# EAGLE schematic stm32-40 (EAGLE 6.5.0)
40 pin mesonine module. 2 inch beetween pinheads.

## Sheet 1 of 2
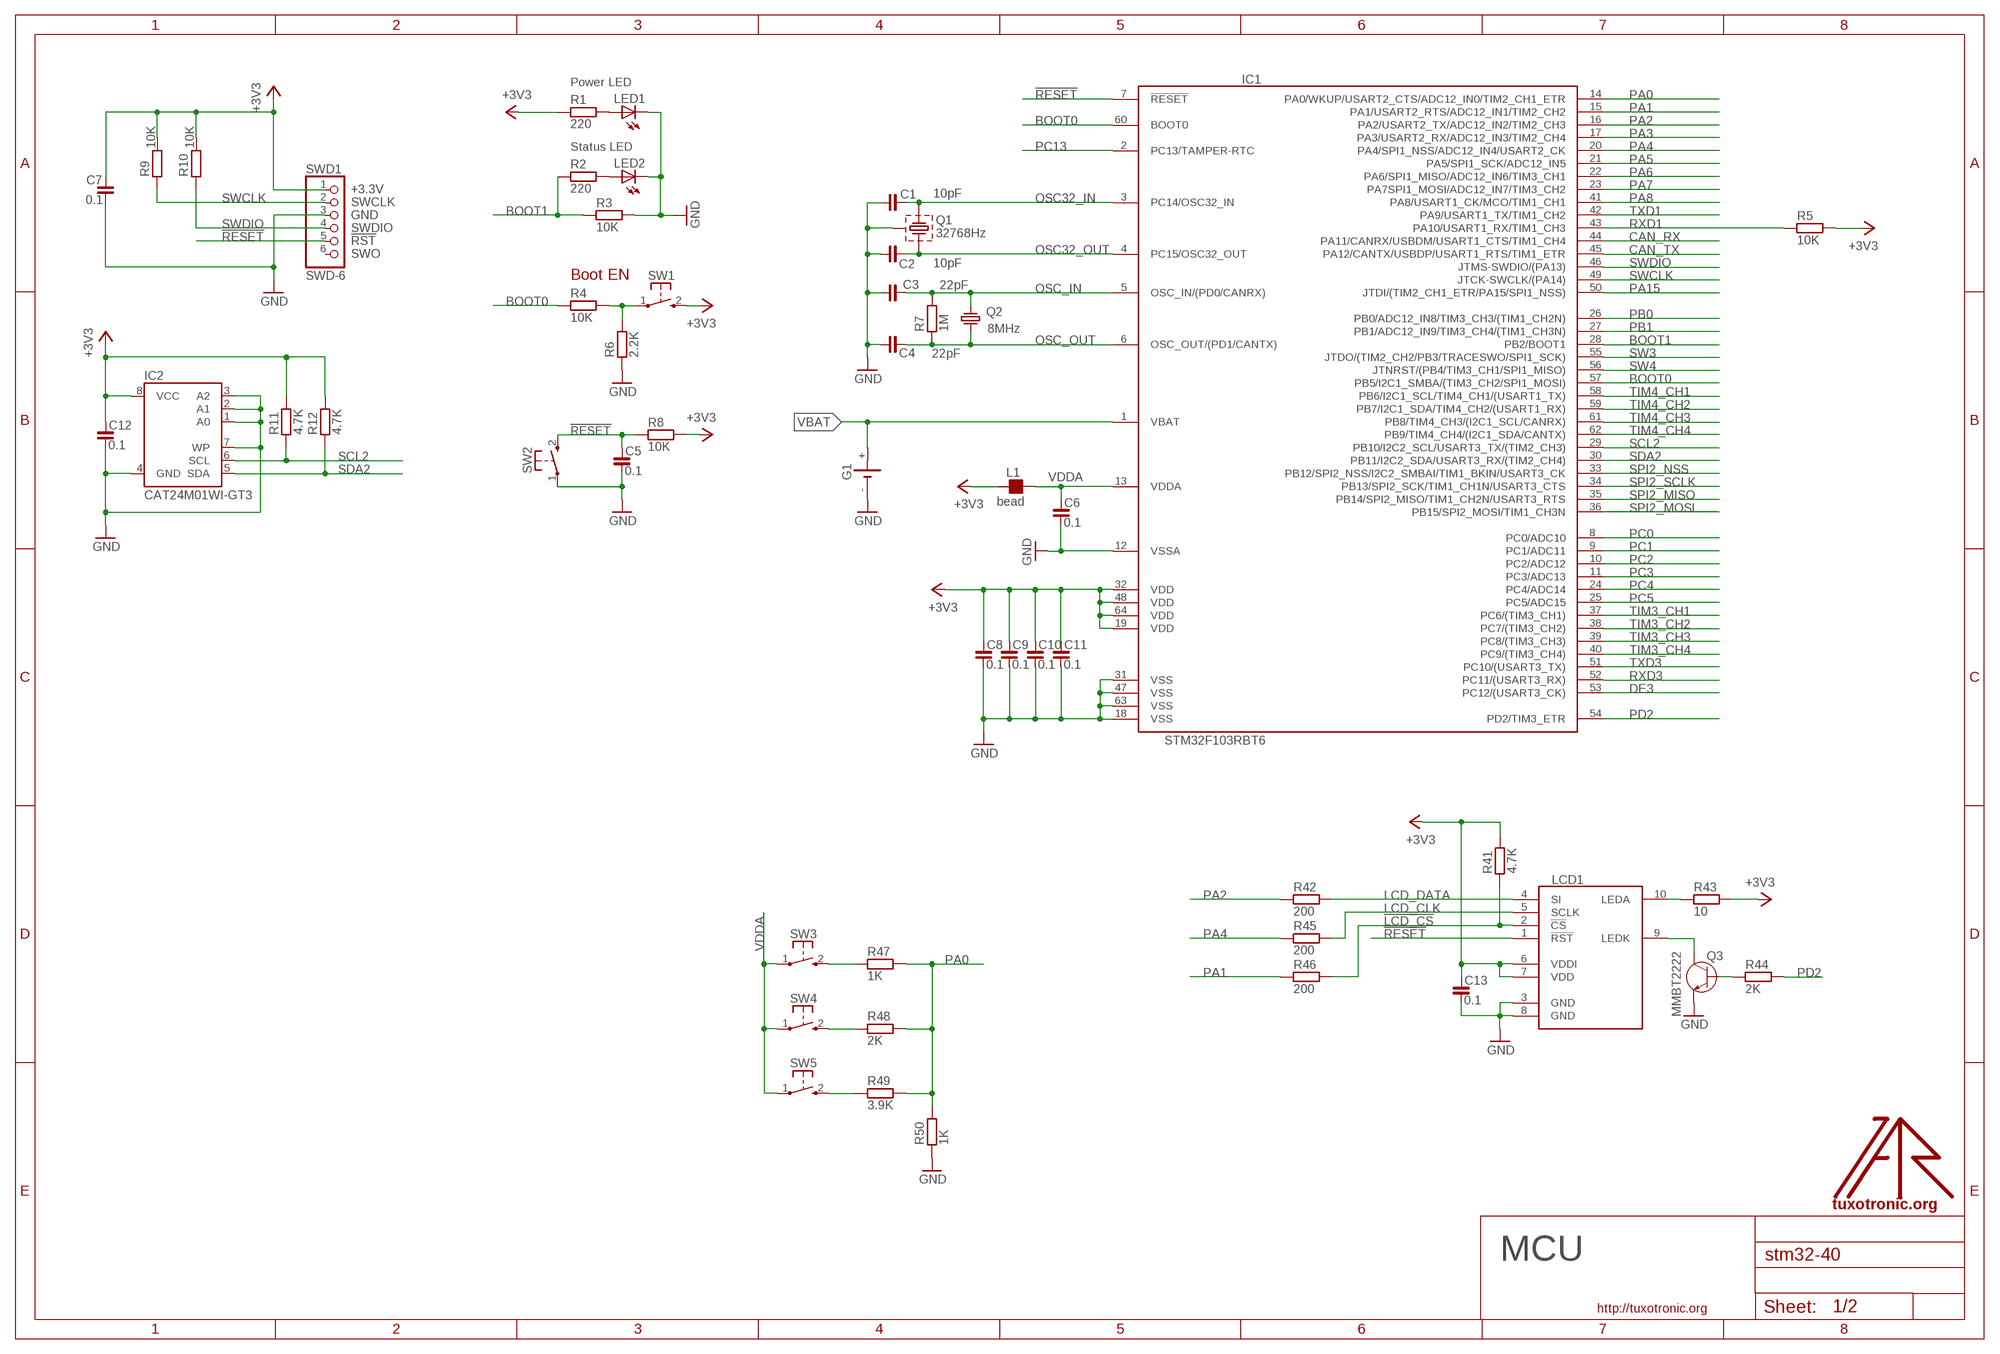
[diagram p0: schematic, sheet 1]

### Parts
C1  10pF  C_0603  [C0603]
C2  10pF  C_0603  [C0603]
C3  22pF  C_0603  [C0603]
C4  22pF  C_0603  [C0603]
C5  0.1  C_0603  [C0603]
C6  0.1  C_0603  [C0603]
C7  0.1  C_0603  [C0603]
C8  0.1  C_0603  [C0603]
C9  0.1  C_0603  [C0603]
C10  0.1  C_0603  [C0603]
C11  0.1  C_0603  [C0603]
C12  0.1  C_0603  [C0603]
C13  0.1  C_0603  [C0603]
G1  1220SMT  [SMT1220]
IC1  STM32F103RBT6  STM32F103R  [TQFP64]
IC2  CAT24M01WI-GT3  AT24C256S  [SO08]
L1  bead  FB_0603  [L0603]
LCD1  LCD1202-EXT  [NOKIA1202LCD-EXT]
LED1  LEDCHIP-LED0805  [CHIP-LED0805]
LED2  LEDCHIP-LED0805  [CHIP-LED0805]
Q1  32768Hz  CRSTL3-  [TC38H-G]
Q2  8MHz  CRYSTAL-HC49S  [HC49/S]
Q3  MMBT2222  [SOT23]
R1  220  R_0603  [R0603]
R2  220  R_0603  [R0603]
R3  10K  R_0603  [R0603]
R4  10K  R_0603  [R0603]
R5  10K  R_0603  [R0603]
R6  2.2K  R_0603  [R0603]
R7  1M  R_0603  [R0603]
R8  10K  R_0603  [R0603]
R9  10K  R_0603  [R0603]
R10  10K  R_0603  [R0603]
R11  4.7K  R_0603  [R0603]
R12  4.7K  R_0603  [R0603]
R41  4.7K  R_0603  [R0603]
R42  200  R_0603  [R0603]
R43  10  R_0603  [R0603]
R44  2K  R_0603  [R0603]
R45  200  R_0603  [R0603]
R46  200  R_0603  [R0603]
R47  1K  R_0603  [R0603]
R48  2K  R_0603  [R0603]
R49  3.9K  R_0603  [R0603]
R50  1K  R_0603  [R0603]
SW1  KSS-2EG4430  [KSS-2EG4430]
SW2  KSS-2EG4430  [KSS-2EG4430]
SW3  KSS-2EG4430  [KSS-2EG4430]
SW4  KSS-2EG4430  [KSS-2EG4430]
SW5  KSS-2EG4430  [KSS-2EG4430]
SWD1  SWD-6  [JTAG6PIN]
U$1  LOGO  [TT_LOGO]

### Nets
!LCD_CS: LCD1.2(!CS) R41.1 R46.2
!RESET: C5.1 IC1.7(!RESET) LCD1.1(!RST) R8.1 SW2.2(S) SWD1.5
+3V3: C7.1 C8.1 C9.1 C10.1 C11.1 C12.1 C13.1 IC1.19(VDD) IC1.32(VDD) IC1.48(VDD) IC1.64(VDD) IC2.8(VCC) L1.1 LCD1.6(VDDI) LCD1.7(VDD) R1.1 R5.2 R8.2 R9.2 R10.2 R11.2 R12.2 R41.2 R43.2 SW1.2(S) SWD1.1 ; also sheet 2
BOOT0: IC1.57(PB5/I2C1_SMBA/(TIM3_CH2/SPI1_MOSI)) IC1.60(BOOT0) R4.1
BOOT1: IC1.28(PB2/BOOT1) R2.1 R3.1
CAN_RX: IC1.44(PA11/CANRX/USBDM/USART1_CTS/TIM1_CH4) ; also sheet 2
CAN_TX: IC1.45(PA12/CANTX/USBDP/USART1_RTS/TIM1_ETR) ; also sheet 2
DE3: IC1.53(PC12/(USART3_CK)) ; also sheet 2
GND: C1.2 C2.2 C3.2 C4.2 C5.2 C6.2 C7.2 C8.2 C9.2 C10.2 C11.2 C12.2 C13.2 G1.- IC1.12(VSSA) IC1.18(VSS) IC1.31(VSS) IC1.47(VSS) IC1.63(VSS) IC2.1(A0) IC2.2(A1) IC2.3(A2) IC2.4(GND) IC2.7(WP) LCD1.3(GND) LCD1.8(GND) LED1.C LED2.C Q1.GND Q3.2(E) R3.2 R6.1 R50.1 SW2.1(P) SWD1.3 ; also sheet 2
LCD_CLK: LCD1.5(SCLK) R45.2
LCD_DATA: LCD1.4(SI) R42.2
N$3: R4.2 R6.2 SW1.1(P)
N$13: LED1.A R1.2
N$29: LCD1.9(LEDK) Q3.3(C)
N$30: LED2.A R2.2
N$31: LCD1.10(LEDA) R43.1
N$32: Q3.1(B) R44.1
N$33: R47.1 SW3.2(S)
N$34: R48.1 SW4.2(S)
N$35: R49.1 SW5.2(S)
OSC32_IN: C1.1 IC1.3(PC14/OSC32_IN) Q1.2
OSC32_OUT: C2.1 IC1.4(PC15/OSC32_OUT) Q1.1
OSC_IN: C3.1 IC1.5(OSC_IN/(PD0/CANRX)) Q2.1 R7.2
OSC_OUT: C4.1 IC1.6(OSC_OUT/(PD1/CANTX)) Q2.2 R7.1
PA0: IC1.14(PA0/WKUP/USART2_CTS/ADC12_IN0/TIM2_CH1_ETR) R47.2 R48.2 R49.2 R50.2 ; also sheet 2
PA1: IC1.15(PA1/USART2_RTS/ADC12_IN1/TIM2_CH2) R46.1 ; also sheet 2
PA2: IC1.16(PA2/USART2_TX/ADC12_IN2/TIM2_CH3) R42.1 ; also sheet 2
PA3: IC1.17(PA3/USART2_RX/ADC12_IN3/TIM2_CH4) ; also sheet 2
PA4: IC1.20(PA4/SPI1_NSS/ADC12_IN4/USART2_CK) R45.1 ; also sheet 2
PA5: IC1.21(PA5/SPI1_SCK/ADC12_IN5) ; also sheet 2
PA6: IC1.22(PA6/SPI1_MISO/ADC12_IN6/TIM3_CH1) ; also sheet 2
PA7: IC1.23(PA7SPI1_MOSI/ADC12_IN7/TIM3_CH2) ; also sheet 2
PA8: IC1.41(PA8/USART1_CK/MCO/TIM1_CH1) ; also sheet 2
PA15: IC1.50(JTDI/(TIM2_CH1_ETR/PA15/SPI1_NSS)) ; also sheet 2
PB0: IC1.26(PB0/ADC12_IN8/TIM3_CH3/(TIM1_CH2N)) ; also sheet 2
PB1: IC1.27(PB1/ADC12_IN9/TIM3_CH4/(TIM1_CH3N)) ; also sheet 2
PC0: IC1.8(PC0/ADC10) ; also sheet 2
PC1: IC1.9(PC1/ADC11) ; also sheet 2
PC2: IC1.10(PC2/ADC12) ; also sheet 2
PC3: IC1.11(PC3/ADC13) ; also sheet 2
PC4: IC1.24(PC4/ADC14) ; also sheet 2
PC5: IC1.25(PC5/ADC15) ; also sheet 2
PC13: IC1.2(PC13/TAMPER-RTC) ; also sheet 2
PD2: IC1.54(PD2/TIM3_ETR) R44.2 ; also sheet 2
RXD1: IC1.43(PA10/USART1_RX/TIM1_CH3) R5.1 ; also sheet 2
RXD3: IC1.52(PC11/(USART3_RX)) ; also sheet 2
SCL2: IC1.29(PB10/I2C2_SCL/USART3_TX/(TIM2_CH3)) IC2.6(SCL) R11.1 ; also sheet 2
SDA2: IC1.30(PB11/I2C2_SDA/USART3_RX/(TIM2_CH4)) IC2.5(SDA) R12.1 ; also sheet 2
SPI2_MISO: IC1.35(PB14/SPI2_MISO/TIM1_CH2N/USART3_RTS) ; also sheet 2
SPI2_MOSI: IC1.36(PB15/SPI2_MOSI/TIM1_CH3N) ; also sheet 2
SPI2_NSS: IC1.33(PB12/SPI2_NSS/I2C2_SMBAI/TIM1_BKIN/USART3_CK) ; also sheet 2
SPI2_SCLK: IC1.34(PB13/SPI2_SCK/TIM1_CH1N/USART3_CTS) ; also sheet 2
SW3: IC1.55(JTDO/(TIM2_CH2/PB3/TRACESWO/SPI1_SCK)) ; also sheet 2
SW4: IC1.56(JTNRST/(PB4/TIM3_CH1/SPI1_MISO)) ; also sheet 2
SWCLK: IC1.49(JTCK-SWCLK/(PA14)) R9.1 SWD1.2
SWDIO: IC1.46(JTMS-SWDIO/(PA13)) R10.1 SWD1.4
TIM3_CH1: IC1.37(PC6/(TIM3_CH1)) ; also sheet 2
TIM3_CH2: IC1.38(PC7/(TIM3_CH2)) ; also sheet 2
TIM3_CH3: IC1.39(PC8/(TIM3_CH3)) ; also sheet 2
TIM3_CH4: IC1.40(PC9/(TIM3_CH4)) ; also sheet 2
TIM4_CH1: IC1.58(PB6/I2C1_SCL/TIM4_CH1/(USART1_TX)) ; also sheet 2
TIM4_CH2: IC1.59(PB7/I2C1_SDA/TIM4_CH2/(USART1_RX)) ; also sheet 2
TIM4_CH3: IC1.61(PB8/TIM4_CH3/(I2C1_SCL/CANRX)) ; also sheet 2
TIM4_CH4: IC1.62(PB9/TIM4_CH4/(I2C1_SDA/CANTX)) ; also sheet 2
TXD1: IC1.42(PA9/USART1_TX/TIM1_CH2) ; also sheet 2
TXD3: IC1.51(PC10/(USART3_TX)) ; also sheet 2
VBAT: G1.+ IC1.1(VBAT)
VDDA: C6.1 IC1.13(VDDA) L1.2 SW3.1(P) SW4.1(P) SW5.1(P)
Unconnected: SWD1.6

### Notes on the sheet
- Power LED
- Status LED
- Boot EN
- MCU

## Sheet 2 of 2
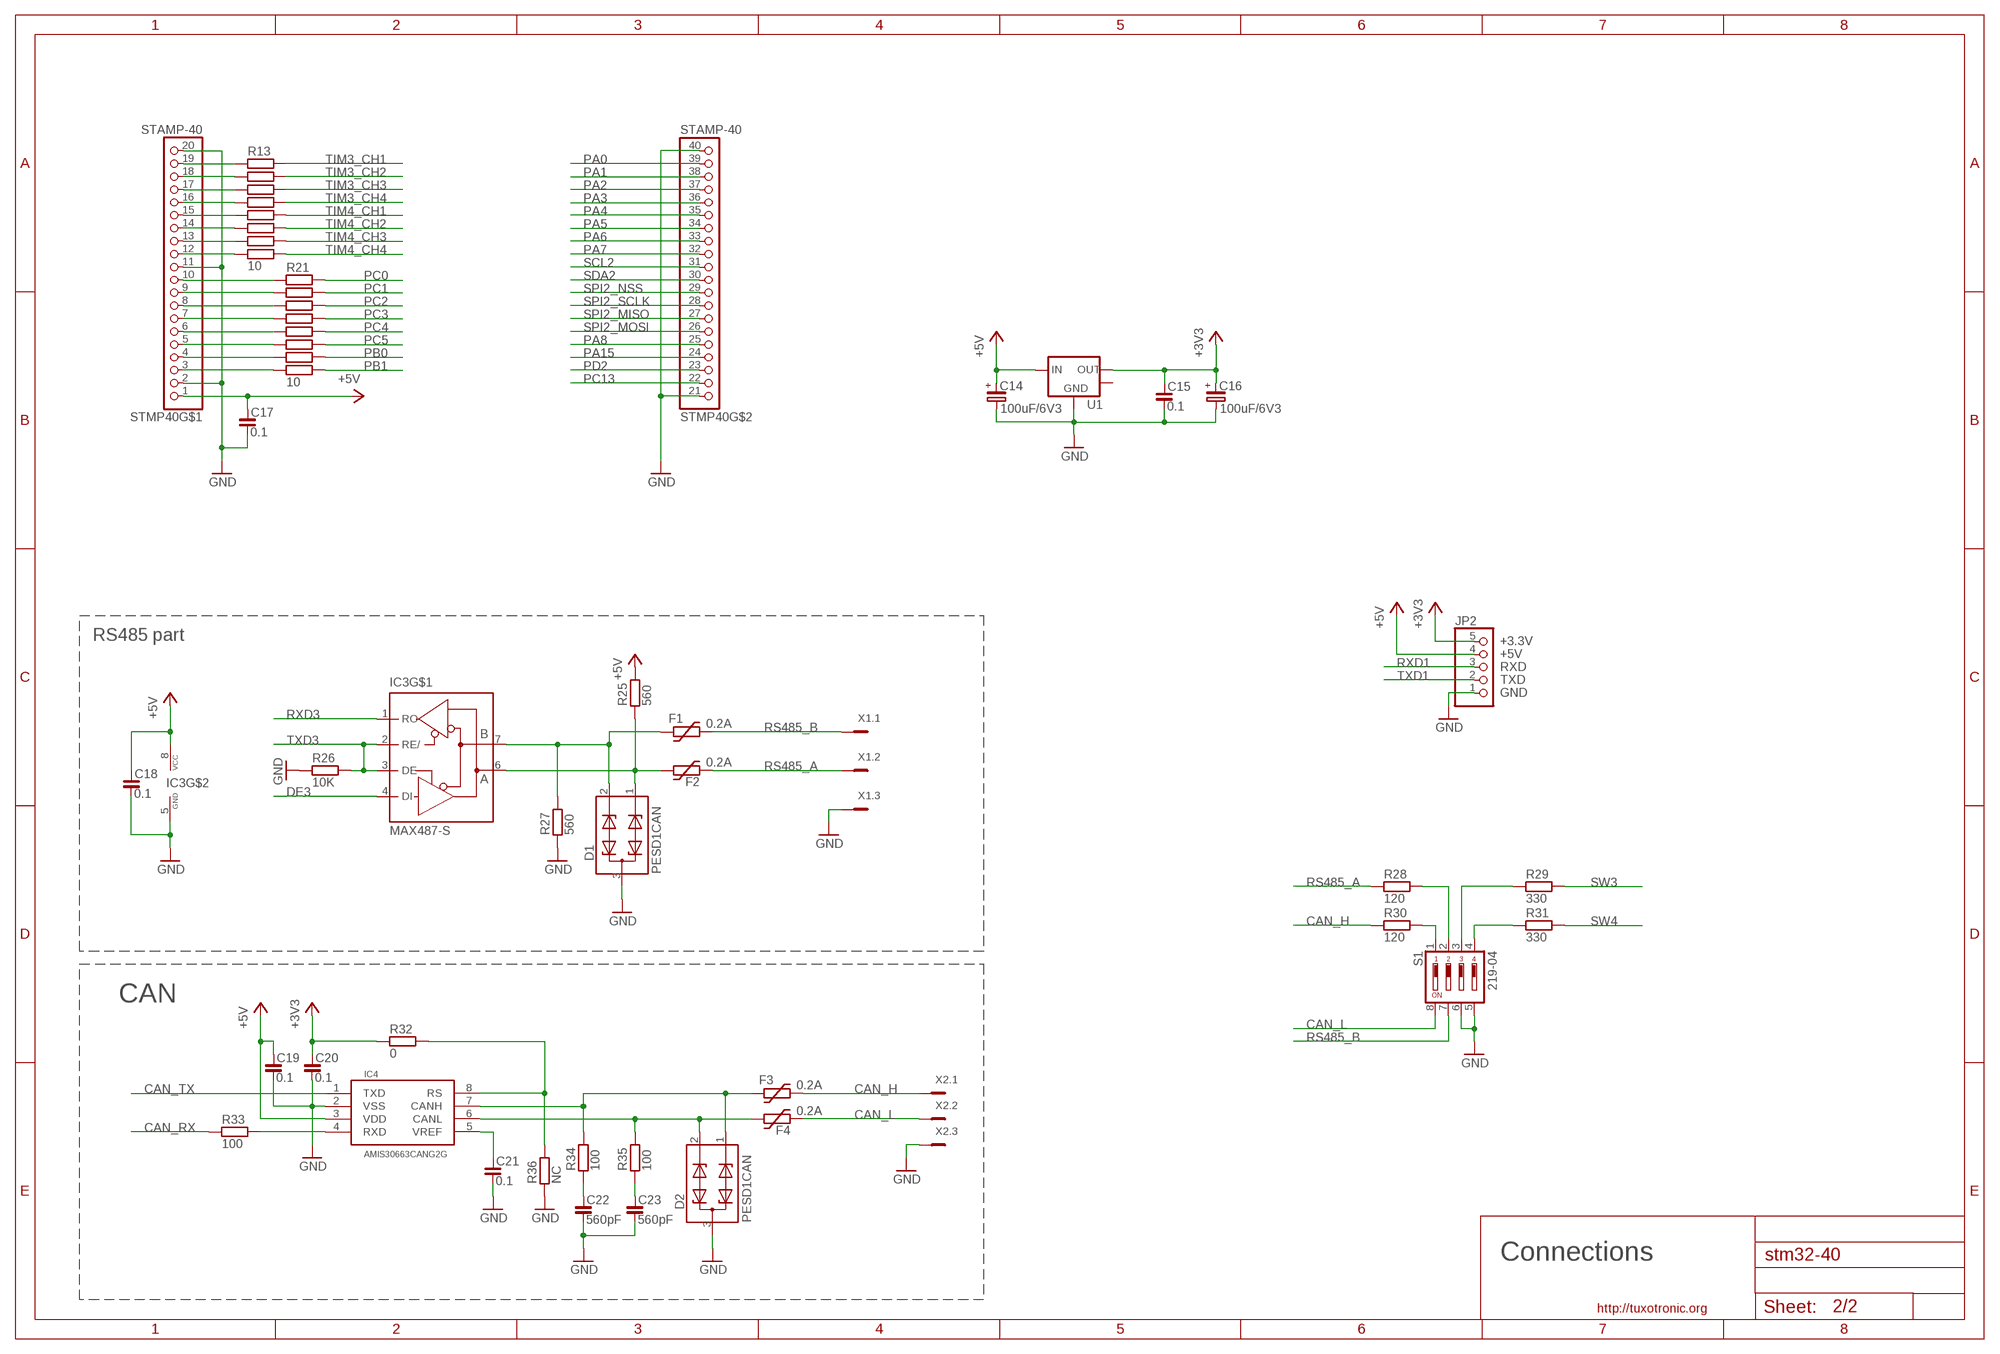
[diagram p1: schematic, sheet 2]

### Parts
C14  100uF/6V3  CP_SMCD  [SMC_D]
C15  0.1  C_0805  [C0805]
C16  100uF/6V3  CP_SMCD  [SMC_D]
C17  0.1  C_0805  [C0805]
C18  0.1  C_0603  [C0603]
C19  0.1  C_0603  [C0603]
C20  0.1  C_0603  [C0603]
C21  0.1  C_0603  [C0603]
C22  560pF  C_0603  [C0603]
C23  560pF  C_0603  [C0603]
D1  PESD1CAN  [SOT23]
D2  PESD1CAN  [SOT23]
F1  0.2A  1206L  [1206L]
F2  0.2A  1206L  [1206L]
F3  0.2A  1206L  [1206L]
F4  0.2A  1206L  [1206L]
IC3  MAX487-S  [SO08]
IC4  AMIS30663CANG2G  SN65HVD230  [SO08]
JP2  UART-5_2.54  [UART_1X05]
R13  10  R_0603  [R0603]
R14  10  R_0603  [R0603]
R15  10  R_0603  [R0603]
R16  10  R_0603  [R0603]
R17  10  R_0603  [R0603]
R18  10  R_0603  [R0603]
R19  10  R_0603  [R0603]
R20  10  R_0603  [R0603]
R21  10  R_0603  [R0603]
R22  10  R_0603  [R0603]
R23  10  R_0603  [R0603]
R24  10  R_0603  [R0603]
R25  560  R_0603  [R0603]
R26  10K  R_0603  [R0603]
R27  560  R_0603  [R0603]
R28  120  R_0805  [R0805]
R29  330  R_0603  [R0603]
R30  120  R_0805  [R0805]
R31  330  R_0603  [R0603]
R32  0  R_0603  [R0603]
R33  100  R_0603  [R0603]
R34  100  R_0603  [R0603]
R35  100  R_0603  [R0603]
R36  NC  R_0603  [R0603]
R37  10  R_0603  [R0603]
R38  10  R_0603  [R0603]
R39  10  R_0603  [R0603]
R40  10  R_0603  [R0603]
S1  219-04  [CTS-219-04]
STMP40  STAMP-40  [STAMP-40]
U1  LM1117-3.3  [SOT223]
X1  MCV3  [MCV3]
X2  MCV3  [MCV3]

### Nets
+3V3: C15.1 C16.+ C20.1 JP2.5 R32.1 U1.2(OUT) ; also sheet 1
+5V: C14.+ C17.1 C18.1 C19.1 IC3.8(VCC) IC4.3(VDD) JP2.4 R25.2 STMP40.1 U1.3(IN)
CAN_CTRL: IC4.8(RS) R32.2 R36.2
CAN_H: F3.P$2 R30.1 X2.1
CAN_L: F4.P$2 S1.8 X2.2
CAN_RX: R33.1 ; also sheet 1
CAN_TX: IC4.1(TXD) ; also sheet 1
DE3: IC3.4(DI) ; also sheet 1
GND: C14.- C15.2 C16.- C17.2 C18.2 C19.2 C20.2 C21.2 C22.2 C23.2 D1.3 D2.3 IC3.5(GND) IC4.2(VSS) JP2.1 R26.1 R27.1 R36.1 S1.5 S1.6 STMP40.2 STMP40.11 STMP40.20 STMP40.21 STMP40.40 U1.1(GND) X1.3 X2.3 ; also sheet 1
N$1: C21.1 IC4.5(VREF)
N$2: R30.2 S1.1
N$6: D1.2 F1.P$1 IC3.7(B) R27.2
N$7: IC4.4(RXD) R33.2
N$8: R28.2 S1.2
N$9: R29.1 S1.3
N$10: R31.1 S1.4
N$11: R21.1 STMP40.10
N$14: R22.1 STMP40.9
N$15: R13.1 STMP40.19
N$16: R14.1 STMP40.18
N$17: R15.1 STMP40.17
N$18: R16.1 STMP40.16
N$19: R17.1 STMP40.15
N$20: R18.1 STMP40.14
N$21: R19.1 STMP40.13
N$22: R20.1 STMP40.12
N$23: R23.1 STMP40.8
N$24: R24.1 STMP40.7
N$25: R37.1 STMP40.6
N$26: R38.1 STMP40.5
N$27: R39.1 STMP40.4
N$28: R40.1 STMP40.3
N$44: D1.1 F2.P$1 IC3.6(A) R25.1
N$51: D2.1 F3.P$1 IC4.7(CANH) R34.2
N$52: D2.2 F4.P$1 IC4.6(CANL) R35.2
N$54: C23.1 R35.1
N$55: C22.1 R34.1
PA0: STMP40.39 ; also sheet 1
PA1: STMP40.38 ; also sheet 1
PA2: STMP40.37 ; also sheet 1
PA3: STMP40.36 ; also sheet 1
PA4: STMP40.35 ; also sheet 1
PA5: STMP40.34 ; also sheet 1
PA6: STMP40.33 ; also sheet 1
PA7: STMP40.32 ; also sheet 1
PA8: STMP40.25 ; also sheet 1
PA15: STMP40.24 ; also sheet 1
PB0: R39.2 ; also sheet 1
PB1: R40.2 ; also sheet 1
PC0: R21.2 ; also sheet 1
PC1: R22.2 ; also sheet 1
PC2: R23.2 ; also sheet 1
PC3: R24.2 ; also sheet 1
PC4: R37.2 ; also sheet 1
PC5: R38.2 ; also sheet 1
PC13: STMP40.22 ; also sheet 1
PD2: STMP40.23 ; also sheet 1
RS485_A: F2.P$2 R28.1 X1.2
RS485_B: F1.P$2 S1.7 X1.1
RXD1: JP2.3 ; also sheet 1
RXD3: IC3.1(RO) ; also sheet 1
SCL2: STMP40.31 ; also sheet 1
SDA2: STMP40.30 ; also sheet 1
SPI2_MISO: STMP40.27 ; also sheet 1
SPI2_MOSI: STMP40.26 ; also sheet 1
SPI2_NSS: STMP40.29 ; also sheet 1
SPI2_SCLK: STMP40.28 ; also sheet 1
SW3: R29.2 ; also sheet 1
SW4: R31.2 ; also sheet 1
TIM3_CH1: R13.2 ; also sheet 1
TIM3_CH2: R14.2 ; also sheet 1
TIM3_CH3: R15.2 ; also sheet 1
TIM3_CH4: R16.2 ; also sheet 1
TIM4_CH1: R17.2 ; also sheet 1
TIM4_CH2: R18.2 ; also sheet 1
TIM4_CH3: R19.2 ; also sheet 1
TIM4_CH4: R20.2 ; also sheet 1
TXD1: JP2.2 ; also sheet 1
TXD3: IC3.2(RE/) IC3.3(DE) R26.2 ; also sheet 1
Unconnected: U1.4(MASS)

### Notes on the sheet
- RS485 part
- CAN
- Connections

## Library data of the parts
C1-C13 C15 C17-C23 = rc-master-smd:C_: NON-POLARIZED CAP
C14 C16 = rc-master-smd:CP_: POLARIZED CAP
D1 D2 = protect:PESD1CAN: Features Due to the integrated diode structure only one small SOT23 package is needed to protect two CAN bus lines Max. peak pulse power: PPP = 200 W at tp = 8/20 ?s Low clamping voltage: VCL = 40 V at IPP = 1 A Ultra low leakage current: IRM < 1 nA ESD protection up to 23 kV IEC 61000-4-2, level 4 (ESD) IEC 61000-4-5 (surge); IPP = 3 A at tp = 8/20 ?s Small SMD plastic package Applications CAN bus protection Automotive applications
F1-F4 = ptc-littlefuse:1206L
G1 = battery:1220SMT
IC1 = stm32:STM32F103R: Medium-density performance line ARM-based 32-bit MCU with 64 or 128 KB Flash, USB, CAN, 7 timers, 2 ADCs, 9 communication interfaces
IC2 = stm32-by-pb:AT24C*: 2-wire serial EEPROM
IC3 = rs232-rs485:MAX487: RS485 TRANSEIVER
IC4 = interfaces:SN65HVD230: CAN PHY driver
JP2 = stamp:UART-5: PIN HEADER
L1 = rc-master-smd:FB_: FERRITE BEAD
LCD1 = lcd1202:LCD1202: 1.3" b/w graphics display 96x68 pixel. From Nokia 1202 cell phone
LED1 LED2 = led:LED: LED OSRAM: - CHIPLED LG R971, LG N971, LY N971, LG Q971, LY Q971, LO R971, LY R971 LH N974, LH R974 LS Q976, LO Q976, LY Q976 LO Q996 - Hyper CHIPLED LW Q18S LB Q993, LB Q99A, LB R99A - SideLED LS A670, LO A670, LY A670, LG A670, LP A670 LB A673, LV A673, LT A673, LW A673 LH A674 LY A675 LS A676, LA A676, LO A676, LY A676, LW A676 LS A679, LY A679, LG A679 - Hyper Micro SIDELED® LS Y876, LA Y876, LO Y876, LY Y876 LT Y87S - SmartLED LW L88C, LW L88S LB L89C, LB L89S, LG L890 LS L89K, LO L89K, LY L89K LS L896, LA L896, LO L896, LY L896 - TOPLED LS T670, LO T670, LY T670, LG T670, LP T670 LSG T670, LSP T670, LSY T670, LOP T670, LYG T670 LG T671, LOG T671, LSG T671 LB T673, LV T673, LT T673, LW T673 LH T674 LS T676, LA T676, LO T676, LY T676, LB T676, LH T676, LSB T676, LW T676 LB T67C, LV T67C, LT T67C, LS T67K, LO T67K, LY T67K, LW E67C LS E67B, LA E67B, LO E67B, LY E67B, LB E67C, LV E67C, LT E67C LW T67C LS T679, LY T679, LG T679 LS T770, LO T770, LY T770, LG T770, LP T770 LB T773, LV T773, LT T773, LW T773 LH T774 LS E675, LA E675, LY E675, LS T675 LS T776, LA T776, LO T776, LY T776, LB T776 LHGB T686 LT T68C, LB T68C - Hyper Mini TOPLED® LB M676 - Mini TOPLED Santana® LG M470 LS M47K, LO M47K, LY M47K Source: http://www.osram.convergy.de - LUMILED® LXK2-PW12-R00, LXK2-PW12-S00, LXK2-PW14-U00, LXK2-PW14-V00 LXK2-PM12-R00, LXK2-PM12-S00, LXK2-PM14-U00 LXK2-PE12-Q00, LXK2-PE12-R00, LXK2-PE12-S00, LXK2-PE14-T00, LXK2-PE14-U00 LXK2-PB12-K00, LXK2-PB12-L00, LXK2-PB12-M00, LXK2-PB14-N00, LXK2-PB14-P00, LXK2-PB14-Q00 LXK2-PR12-L00, LXK2-PR12-M00, LXK2-PR14-Q00, LXK2-PR14-R00 LXK2-PD12-Q00, LXK2-PD12-R00, LXK2-PD12-S00 LXK2-PH12-R00, LXK2-PH12-S00 LXK2-PL12-P00, LXK2-PL12-Q00, LXK2-PL12-R00 Source: www.luxeon.com
Q1 = crystal:CRSTL3-
Q2 = discrete:CRYSTAL-: CRYSTAL
Q3 = semiconductor:MMBT2222: General Purpose Transistors NPN Silicon Rating MMBT2222LT1G MMBT2222ALT1G Collector-Emitter Voltage (VCEO) 30 Vdc 40 Vdc Collector-Base Voltage (VCBO) 60 Vdc 75 Vdc Emitter-Base Voltage (VEBO) 5.0 Vdc 6.0 Vdc Collector Current Continuous (IC) 600 mAdc 1100 mAdc Collector Current Peak (ICM) 600 mAdc 1100 mAdc
R1-R50 = rc-master-smd:R_: RESISTOR
S1 = switch-dil:219-04*: Surface Mount DIP Switch Series 219 SMT CTS Electronic Components Sourc: www.ctscorp.com
STMP40 = stamp:STAMP-40
SW1-SW5 = buttons:KSS-2EG4430: Size: 3x6mm Height: 5mm from PCB Rating: DC12v 50mA Travel: 0.25±0.10mm Operating Force: 180±50gf Return Force: 60gf min Contact resistance: 100m? max Insulation resistance: 100M? min Operating life?50,000 cycles
SWD1 = jtag:SWD-6: STM32Fx Discovery
U1 = vreg-linear:LM1117: Linear regulators
U$1 = logo:LOGO
X1 X2 = con-phoenix-381_l:MCV3: Mini-Combicon 3.81mm vertikal 3polig (ohne Gegenstecker)

## Net classes
0 default: width 0.1 mm, drill 0.1 mm, clearance 0.1 mm